# Altium schematic sheet Bluetooth LE CSR1010.SchDoc
size 209 x 297 mm; Author: Мурашкин Д.В.; Scale: 1:1; Letter1Column: Э
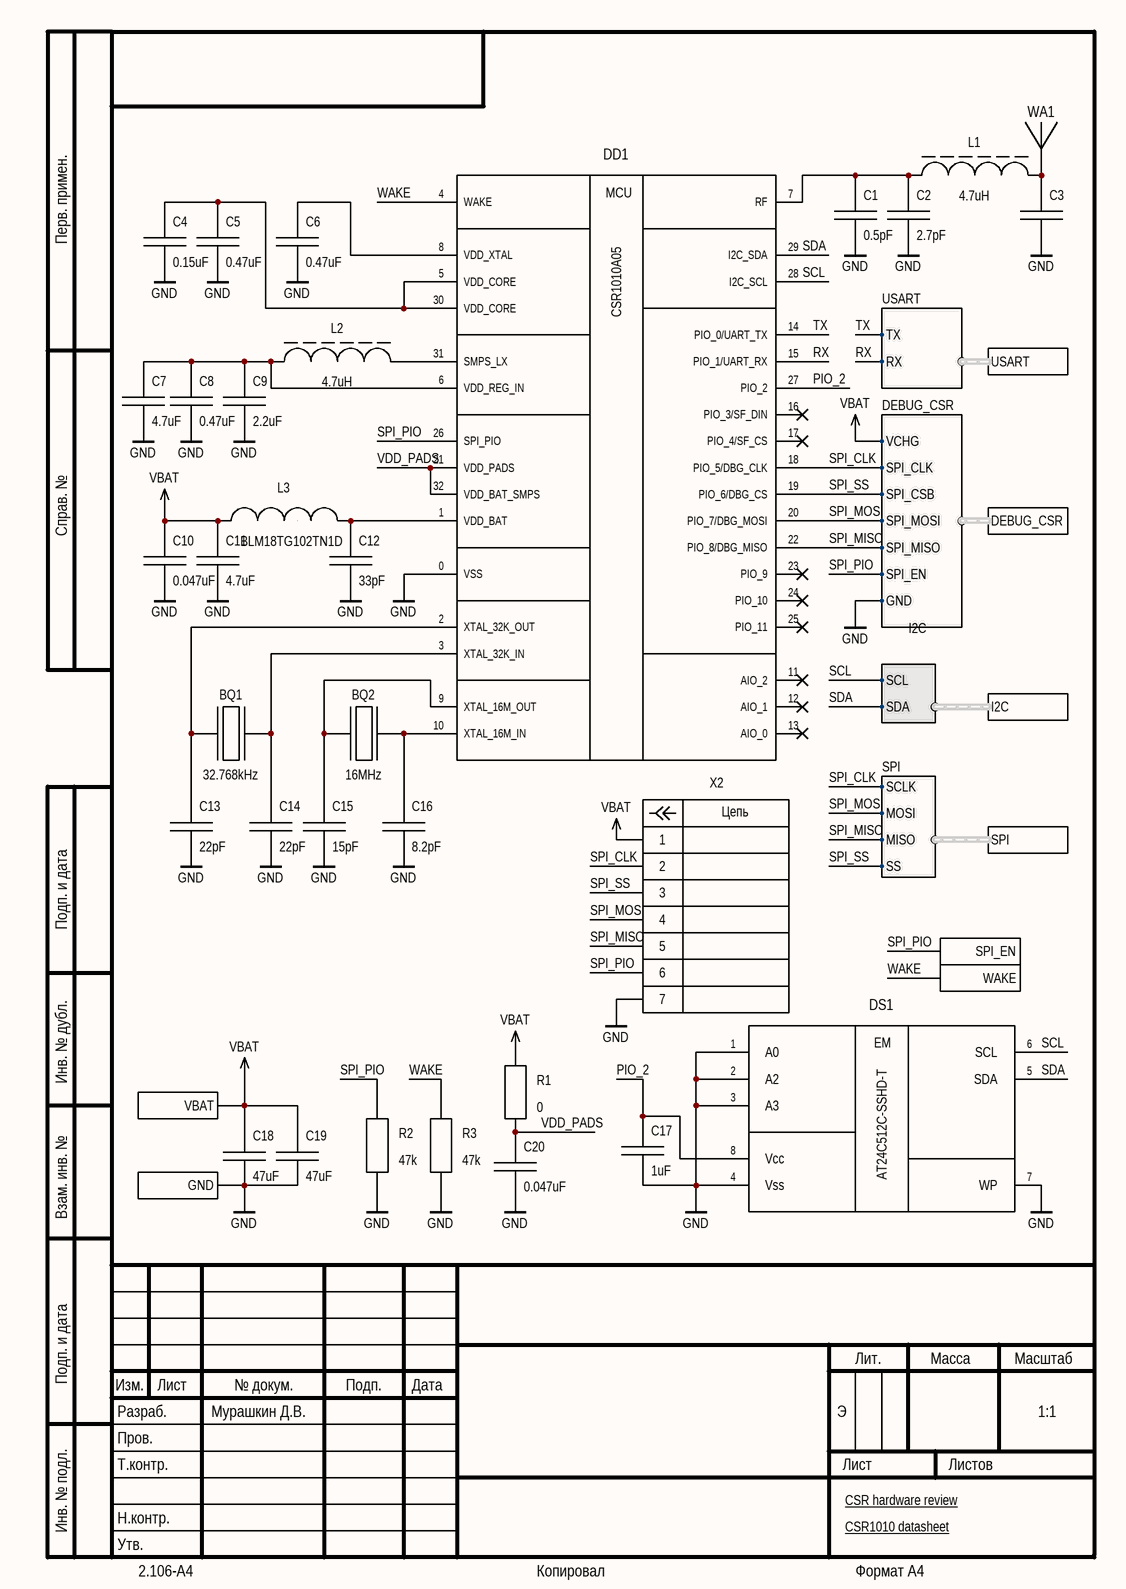
[diagram p0: Bluetooth LE CSR1010.SchDoc]

## Parts
BQ1  32.768kHz  [FX135]
BQ2  16MHz  [FA-238]
C1  0.5pF  [CAPC1608M]
C2  2.7pF  [CAPC1005M]
C3  (no value)  [NM CAPC1005M]  (no BOM)
C4  0.15uF  [CAPC1608M]
C5  0.47uF  [CAPC1608M]
C6  0.47uF  [CAPC1608M]
C7  4.7uF  [CAPC2012M]
C8  0.47uF  [CAPC1608M]
C9  2.2uF  [CAPC1608M]
C10  0.047uF  [CAPC1608M]
C11  4.7uF  [CAPC2012M]
C12  33pF  [CAPC1608M]
C13  22pF  [CAPC1608M]
C14  22pF  [CAPC1608M]
C15  15pF  [CAPC1608M]
C16  8.2pF  [CAPC1608M]
C17  1uF  [CAPC1608M]
C18  47uF  [CAPC2012M]
C19  47uF  [CAPC2012M]
C20  0.047uF  [CAPC1608M]
DD1  CSR1010A05  [UFQFPN-32]
DS1  AT24C512C-SSHD-T  [SOIC-8M]
L1  4.7uH  [INDC1005M]
L2  4.7uH  [INDC1608M]
L3  BLM18TG102TN1D  [FRBC1608M]
R1  0  [RESC1608M]
R2  47k  [RESC1608M]
R3  47k  [RESC1608M]
WA1  Ant BLE  [PCB Antenna Bluetooth]  (value not drawn)  (no BOM)
X2  CSR ISP 7P DK-USB-SPI-10225-1A  [CSR ISP P7]  (value not drawn)  (no BOM)

## Ports
DEBUG_CSR (harness DEBUG_CSR), GND, I2C (harness I2C), SPI (harness SPI), SPI_EN, USART (harness USART), VBAT, WAKE

## Harnesses
USART: TX, RX
DEBUG_CSR: SPI_MOSI, VCHG, SPI_CLK, SPI_CSB, SPI_MISO, GND, SPI_EN
SPI: MOSI, MISO, SCLK, SS
I2C: SCL, SDA

## Nets
GND: BQ2.2 BQ2.4 C1.2 C2.2 C3.2 C4.2 C5.2 C6.2 C7.2 C8.2 C9.2 C10.2 C11.2 C12.2 C13.2 C14.2 C15.2 C16.2 C17.2 C18.2 C19.2 C20.2 DD1.0(VSS) DS1.1(A0) DS1.2(A2) DS1.3(A3) DS1.4(Vss) DS1.7(WP) R2.2 R3.2 X2.7 ; port GND, port DEBUG_CSR.GND
VBAT: C10.1 C11.1 C18.1 C19.1 L3.1 R1.1 X2.1 ; port VBAT, port DEBUG_CSR.VCHG
PIO_2: C17.1 DD1.27(PIO_2) DS1.8(Vcc)
RX: DD1.15(PIO_1/UART_RX) ; port USART.RX
SCL: DD1.28(I2C_SCL) DS1.6(SCL) ; port I2C.SCL
SDA: DD1.29(I2C_SDA) DS1.5(SDA) ; port I2C.SDA
SPI_CLK: DD1.18(PIO_5/DBG_CLK) X2.2 ; port DEBUG_CSR.SPI_CLK, port SPI.SCLK
SPI_MISO: DD1.22(PIO_8/DBG_MISO) X2.5 ; port DEBUG_CSR.SPI_MISO, port SPI.MISO
SPI_MOSI: DD1.20(PIO_7/DBG_MOSI) X2.4 ; port DEBUG_CSR.SPI_MOSI, port SPI.MOSI
SPI_PIO: DD1.26(SPI_PIO) R2.1 X2.6 ; port SPI_EN, port DEBUG_CSR.SPI_EN
SPI_SS: DD1.19(PIO_6/DBG_CS) X2.3 ; port DEBUG_CSR.SPI_CSB, port SPI.SS
TX: DD1.14(PIO_0/UART_TX) ; port USART.TX
VDD_PADS: C20.1 DD1.21(VDD_PADS) DD1.32(VDD_BAT_SMPS) R1.2
WAKE: DD1.4(WAKE) R3.1 ; port WAKE
NetBQ1_1: BQ1.1 C13.1 DD1.2(XTAL_32K_OUT)
NetBQ1_2: BQ1.2 C14.1 DD1.3(XTAL_32K_IN)
NetBQ2_1: BQ2.1 C15.1 DD1.9(XTAL_16M_OUT)
NetBQ2_3: BQ2.3 C16.1 DD1.10(XTAL_16M_IN)
NetC1_1: C1.1 C2.1 DD1.7(RF) L1.1
NetC3_1: C3.1 L1.2 WA1.1
NetC4_1: C4.1 C5.1 DD1.5(VDD_CORE) DD1.30(VDD_CORE)
NetC6_1: C6.1 DD1.8(VDD_XTAL)
NetC7_1: C7.1 C8.1 C9.1 DD1.6(VDD_REG_IN) L2.1
NetC12_1: C12.1 DD1.1(VDD_BAT) L3.2
NetDD1_31: DD1.31(SMPS_LX) L2.2

Not connected (* = marked no-connect by the designer): DD1 11(AIO_2)* 12(AIO_1)* 13(AIO_0)* 16(PIO_3/SF_DIN)* 17(PIO_4/SF_CS)* 23(PIO_9)* 24(PIO_10)* 25(PIO_11)*

## Notes on the sheet
- CSR hardware review <file:///F:/GoogleDrive/Work/100_bluePay/Library/CSR/80-ct310-1_ah_csr1010_hardware_design_review_template.pdf>
- CSR1010 datasheet <file:///F:/GoogleDrive/Work/100_bluePay/Library/CSR/CSR1010%20Data%20Sheet%20CS-231985-DS.pdf>
- Перв. примен.
- Справ. №
- Подп. и дата
- Инв. № дубл.
- Взам. инв. №
- Разраб.
- Изм.
- Лист
- № докум.
- Подп.
- Дата
- Лит.
- Масса
- Масштаб
- Пров.
- Т.контр.
- Листов
- Инв. № подл.
- Утв.
- Н.контр.
- 2.106-A4
- Копировал
- Формат А4
- (in symbol AT24C512C-SSHD-T) EM
- (in symbol CSR1010A05) MCU
- (in symbol CSR ISP 7P DK-USB-SPI-10225-1A) Цепь

## Library data of the parts
BQ1 = FX135A-327: Crystal 32.768kHz; Manufacturer: Fox Electronics; Group: Crystals, Oscillators, Resonators; Frequency Tolerance: ±20ppm; ESR: 70 kOhms; Load Capacitance: 12.5pF; Part name: FX135A-327; Package: Crystal SMD 2P 3.2x1.5; Frequency: 32.768kHz; Dimension: 3.20mm x 1.50mm; Thickness: 0.90mm; Operating Temperature: -40°C +85°C
BQ2 = FA-238 16.0000MA30X-AG0: Crystal 16MHz; Manufacturer: EPSON; Group: Crystals, Oscillators, Resonators; ESR: 80 Ohms; Frequency Tolerance: ±20ppm; Load Capacitance: 7pF; Part name: FA-238 16.0000MA30X-AG0; Package: Crystal SMD 4P 3.2x2.5; Frequency: 16MHz; Dimensions: 3.20mm x 2.50mm; Thickness: 0.70mm; Operating Temperature: -40°C +85°C
C1 = CQ0603ARNPOYBNR50: 0.5pF 250V 0603(1608); Manufacturer: Yageo; Group: Ceramic Capacitors; Temperature Coefficient: NP0, C0G; Tolerance: ±0.05pF; Type: Ceramic; Part name: CQ0603ARNPOYBNR50; Voltage: 250V; Package: 0603 (1608); Value: 0.5pF; Operating Temperature: -55°C +125°C; Mounting Type: Surface Mount; Thickness: 0.90mm; Dimension: 1.60mm x 0.80mm
C2 = CC0402BRNPO9BN2R7: 2.7pF 50V 0402(1005); Manufacturer: Yageo; Group: Ceramic Capacitors; Temperature Coefficient: NP0, C0G; Tolerance: ±0.1pF; Type: Ceramic; Part name: CC0402BRNPO9BN2R7; Voltage: 50V; Package: 0402 (1005); Value: 2.7pF; Operating Temperature: -55°C +125°C; Mounting Type: Surface Mount; Thickness: 0.55mm; Dimension: 1.00mm x 0.50mm
C3 = NM CC 0402(1005): Group: Ceramic Capacitors; Type: Ceramic; Package: 0402 (1005); Mounting Type: Surface Mount; Thickness: 0.55mm; Dimension: 1.00mm x 0.50mm
C4 = CC0603KRX7R8BB154: 0.15uF 25V 0603(1608); Manufacturer: Yageo; Group: Ceramic Capacitors; Temperature Coefficient: X7R; Tolerance: ±10%; Type: Ceramic; Part name: CC0603KRX7R8BB154; Voltage: 25V; Package: 0603 (1608); Value: 0.15uF; Operating Temperature: -55°C +125°C; Mounting Type: Surface Mount; Thickness: 0.90mm; Dimension: 1.60mm x 0.80mm
C5 C6 C8 = CC0603KRX7R6BB474: 0.47uF 10V 0603(1608); Manufacturer: Yageo; Group: Ceramic Capacitors; Temperature Coefficient: X7R; Tolerance: ±10%; Type: Ceramic; Part name: CC0603KRX7R6BB474; Voltage: 10V; Package: 0603 (1608); Value: 0.47uF; Operating Temperature: -55°C +125°C; Mounting Type: Surface Mount; Thickness: 0.90mm; Dimension: 1.60mm x 0.80mm
C7 C11 = CC0805KRX5R5BB475: 4.7uF 6.3V 0805(2012); Manufacturer: Yageo; Group: Ceramic Capacitors; Temperature Coefficient: X5R; Tolerance: ±10%; Type: Ceramic; Part name: CC0805KRX5R5BB475; Voltage: 6.3V; Package: 0805 (2012); Value: 4.7uF; Operating Temperature: -55°C +85°C; Mounting Type: Surface Mount; Thickness: 1.45mm; Dimension: 2.00mm x 1.25mm
C9 = CC0603MRX5R7BB225: 2.2uF 16V 0603(1608); Manufacturer: Yageo; Group: Ceramic Capacitors; Temperature Coefficient: X5R; Tolerance: ±20%; Type: Ceramic; Part name: CC0603MRX5R7BB225; Voltage: 16V; Package: 0603 (1608); Value: 2.2uF; Operating Temperature: -55°C +85°C; Mounting Type: Surface Mount; Thickness: 0.90mm; Dimension: 1.60mm x 0.80mm
C10 C20 = CC0603KRX7R9BB473: 0.047uF 50V 0603(1608); Manufacturer: Yageo; Group: Ceramic Capacitors; Temperature Coefficient: X7R; Tolerance: ±10%; Type: Ceramic; Part name: CC0603KRX7R9BB473; Voltage: 50V; Package: 0603 (1608); Value: 0.047uF; Operating Temperature: -55°C +125°C; Mounting Type: Surface Mount; Thickness: 0.90mm; Dimension: 1.60mm x 0.80mm
C12 = CC0603JRNPO9BN330: 33pF 50V 0603(1608); Manufacturer: Yageo; Group: Ceramic Capacitors; Temperature Coefficient: NP0, C0G; Tolerance: ±5%; Type: Ceramic; Part name: CC0603JRNPO9BN330; Voltage: 50V; Package: 0603 (1608); Value: 33pF; Operating Temperature: -55°C +125°C; Mounting Type: Surface Mount; Thickness: 0.90mm; Dimension: 1.60mm x 0.80mm
C13 C14 = CC0603JRNPO9BN220: 22pF 50V 0603(1608); Manufacturer: Yageo; Group: Ceramic Capacitors; Temperature Coefficient: NP0, C0G; Tolerance: ±5%; Type: Ceramic; Part name: CC0603JRNPO9BN220; Voltage: 50V; Package: 0603 (1608); Value: 22pF; Operating Temperature: -55°C +125°C; Mounting Type: Surface Mount; Thickness: 0.90mm; Dimension: 1.60mm x 0.80mm
C15 = CC0603JRNPO9BN150: 15pF 50V 0603(1608); Manufacturer: Yageo; Group: Ceramic Capacitors; Temperature Coefficient: NP0, C0G; Tolerance: ±5%; Type: Ceramic; Part name: CC0603JRNPO9BN150; Voltage: 50V; Package: 0603 (1608); Value: 15pF; Operating Temperature: -55°C +125°C; Mounting Type: Surface Mount; Thickness: 0.90mm; Dimension: 1.60mm x 0.80mm
C16 = CC0603DRNPO9BN8R2: 8.2pF 50V 0603(1608); Manufacturer: Yageo; Group: Ceramic Capacitors; Temperature Coefficient: NP0, C0G; Tolerance: ±0.5pF; Type: Ceramic; Part name: CC0603DRNPO9BN8R2; Voltage: 50V; Package: 0603 (1608); Value: 8.2pF; Operating Temperature: -55°C +125°C; Mounting Type: Surface Mount; Thickness: 0.90mm; Dimension: 1.60mm x 0.80mm
C17 = CC0603KRX5R6BB105: 1uF 10V 0603(1608); Manufacturer: Yageo; Group: Ceramic Capacitors; Temperature Coefficient: X5R; Tolerance: ±10%; Type: Ceramic; Part name: CC0603KRX5R6BB105; Voltage: 10V; Package: 0603 (1608); Value: 1uF; Operating Temperature: -55°C +85°C; Mounting Type: Surface Mount; Thickness: 0.90mm; Dimension: 1.60mm x 0.80mm
C18 C19 = CC0805MKX5R5BB476: 47uF 6.3V 0805(2012); Manufacturer: Yageo; Group: Ceramic Capacitors; Temperature Coefficient: X5R; Tolerance: ±20%; Type: Ceramic; Part name: CC0805MKX5R5BB476; Voltage: 6.3V; Package: 0805 (2012); Value: 47uF; Operating Temperature: -55°C +85°C; Mounting Type: Surface Mount; Thickness: 1.45mm; Dimension: 2.00mm x 1.25mm
DD1 = CSR1010A05: Bluetooth LE SoC; Manufacturer: CSR; Group: Embeded microcontroller; Package: UFQFPN-32; Part name: CSR1010A05
DS1 = AT24C512C-SSHD-T: EEPROM 512Kb (64K x 8); Manufacturer: Microchip; Group: Memory; Frequency: 1MHz; Voltage supply: 2.5 V - 5.5 V; Interface: I²C; Package: 8-SOIC; Part name: AT24C512C-SSHD-T; Operating temperature: -40°C +85°C; Memory type: EEPROM; Memory size: 512Kb (64K x 8); Thickness: 2.0mm; Dimension: 6.20mm x 5.05mm
L1 = LQP15MN5N1B02D: 5.1nH 140mA 0402(1005); Manufacturer: TDK; Group: Fixed Inductors; Thichness: 0.45mm; DC resistance: 700mOhm; Q/Frequency: 13/500MHz; Tolerance: ±0.1nH; Shielding: Unshielded; Type: Multilayer; Core material: Ferrite; Self resonant frequency: 6GHz; Part name: LQP15MN5N1B02D; Current Rating: 140mA; Package: 0402 (1005); Dimension: 1.00mm x 0.50mm; Operating Temperature: -40°C +85°C; Inductance: 4.7uH
L2 = MLZ1608E4R7M: 4.7uH 60mA 0603(1608); Manufacturer: TDK; Group: Fixed Inductors; Thichness: 0.95mm; DC resistance: 650mOhm; Tolerance: ±20%; Shielding: Shielded; Type: Multilayer; Core material: Ferrite; Part name: MLZ1608E4R7M; Current Rating: 60mA; Package: 0603 (1608); Dimension: 1.60mm x 0.80mm; Operating Temperature: -55°C +125°C; Inductance: 4.7uH
L3 = BLM18TG102TN1D: 100mA 0603(1608); Manufacturer: Samsung Electro-Mechanics; Group: Ferrite Beads and Chips; Current Rating: 1.7A; Thichness: 0.70mm; DC Resistance: 470mOhm; Impedance/Frequency: 1kOhm/100MHz; Part name: BLM18TG102TN1D; Package: 0603 (1608); Dimension: 1.60mm x 0.80mm; Operating Temperature: -55°C +125°C
R1 = RC0603JR-070RL: 0 0603(1608); Manufacturer: Yageo; Group: Ceramic Resistors; Temperature Coefficient: ±100ppm/°C; Tolerance: Jumper; Power: 0.1W; Part name: RC0603JR-070RL; Type: Thin Film; Package: 0603 (1608); Value: 0; Dimension: 1.60mm x 0.80mm; Thickness: 0.55mm; Operating Temperature: -55°C +155°C; Mounting Type: Surface mount
R2 R3 = RC0603JR-0747KL: 47k 0603(1608); Manufacturer: Yageo; Group: Ceramic Resistors; Temperature Coefficient: ±100ppm/°C; Tolerance: ±5%; Power: 0.1W; Part name: RC0603JR-0747KL; Type: Thin Film; Package: 0603 (1608); Value: 47k; Dimension: 1.60mm x 0.80mm; Thickness: 0.55mm; Operating Temperature: -55°C +155°C; Mounting Type: Surface mount
WA1 = Antenna Bluetooth: Group: Wireless; Package: PCB; Part name: Ant BLE
X2 = CSR ISP 7P DK-USB-SPI-10225-1A: Debug CSR ISP Pads for DK-USB-SPI-10225-1A; Group: Connectors; Package: 6 DIP 2.54; Manufacturer: CSR